# Altium schematic sheet Output Level.SchDoc
size A
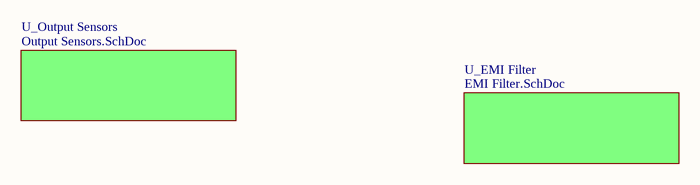
[diagram p0: Output Level.SchDoc]

## Sub-sheets
U_EMI Filter = EMI Filter.SchDoc: no entries
U_Output Sensors = Output Sensors.SchDoc: no entries